# Altium schematic sheet Dano[01].SchDoc: DANO USB C
size A3; Organization: Altium Limited; Address1: L3, 12a Rodborough Rd; Address2: Frenchs Forest; Address3: NSW; Address4: Australia 2086
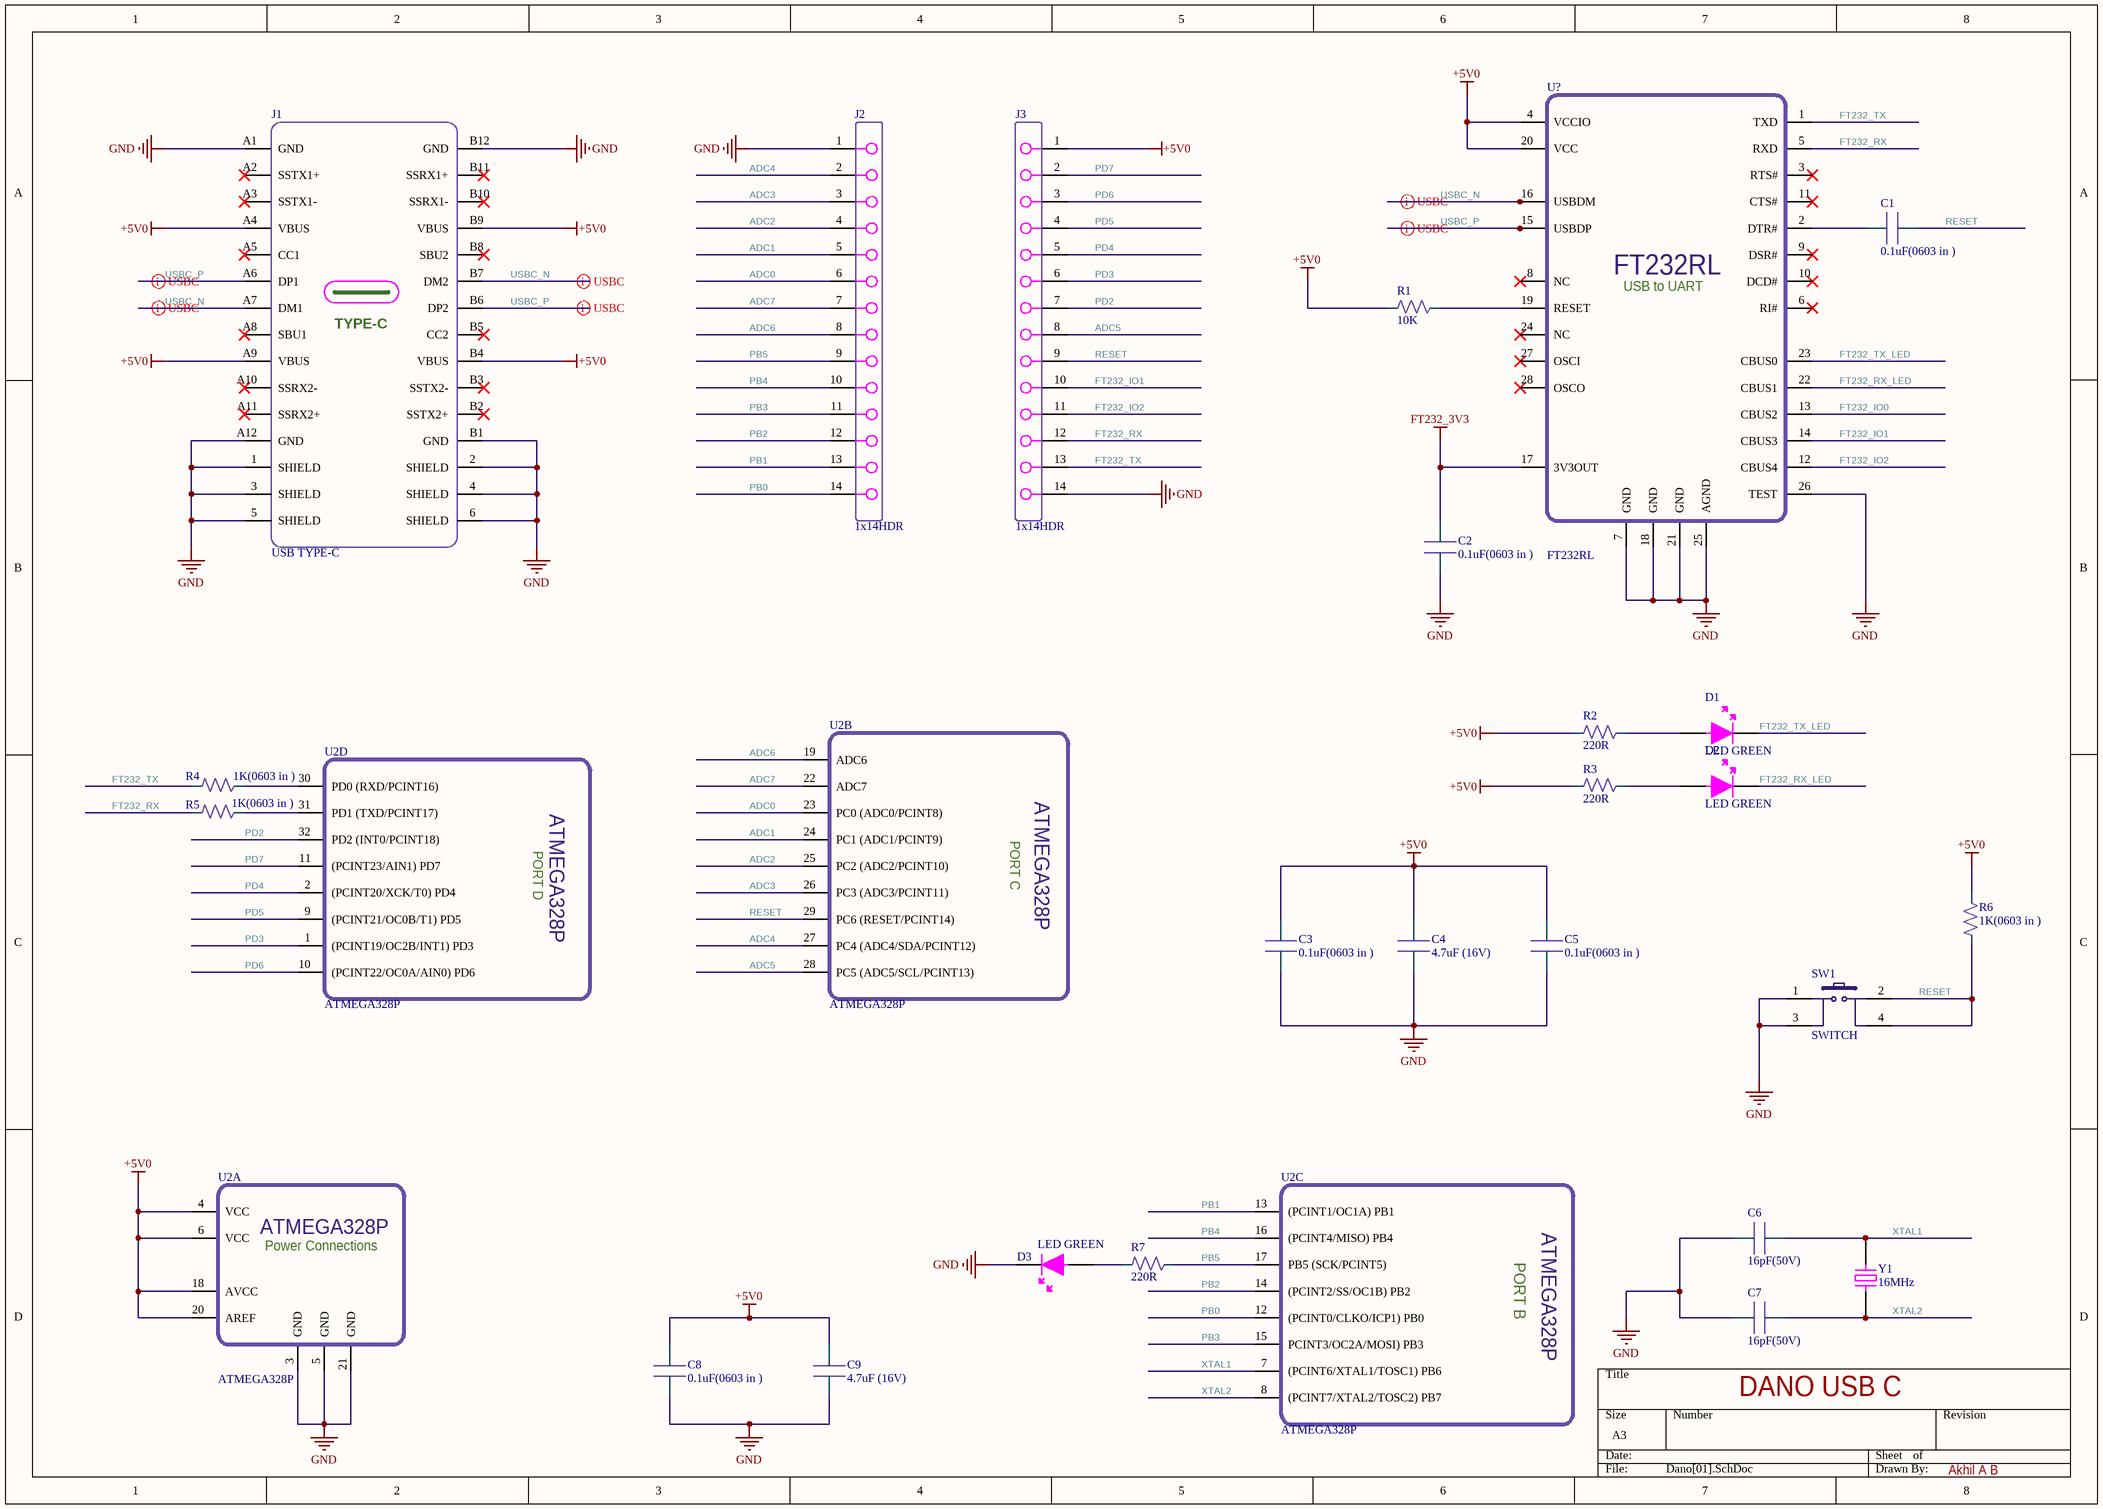
[diagram p0: Dano[01].SchDoc]

## Parts
C1  0.1uF(0603 in )  [Capacitor_0603]
C2  0.1uF(0603 in )  [Capacitor_0603]
C3  0.1uF(0603 in )  [Capacitor_0603]
C4  4.7uF (16V)  [Capacitor_0603]
C5  0.1uF(0603 in )  [Capacitor_0603]
C6  16pF(50V)  [Capacitor_0603]
C7  16pF(50V)  [Capacitor_0603]
C8  0.1uF(0603 in )  [Capacitor_0603]
C9  4.7uF (16V)  [Capacitor_0603]
D1  LED GREEN  [0603_LED]
D2  LED GREEN  [0603_LED]
D3  LED GREEN  [0603_LED]
J1  USB TYPE-C  [USB TYPE C]
J2  1x14HDR  [1x14 HDR_P2.54]
J3  1x14HDR  [1x14 HDR_P2.54]
R1  10K  [RESISTOR0603]
R2  220R  [RESISTOR0603]
R3  220R  [RESISTOR0603]
R4  1K(0603 in )  [RESISTOR0603]
R5  1K(0603 in )  [RESISTOR0603]
R6  1K(0603 in )  [RESISTOR0603]
R7  220R  [RESISTOR0603]
SW1  SWITCH  [PushButton nf]
U2  ATMEGA328P  [32TQFP]  (parts A,B,C,D of 4)
U?  FT232RL  [SSOP28_]
Y1  16MHz  [16MHz_Oscillator]

## Nets
+5V0: C3.2 C4.2 C5.2 C8.2 C9.2 J1.A4(VBUS) J1.A9(VBUS) J1.B4(VBUS) J1.B9(VBUS) J3.1 R1.1 R2.1 R3.1 R6.2 U2.4(VCC) U2.6(VCC) U2.18(AVCC) U2.20(AREF) U?.4(VCCIO) U?.20(VCC)
FT232_3V3: C2.2 U?.17(3V3OUT)
GND: C2.1 C3.1 C4.1 C5.1 C6.1 C7.1 C8.1 C9.1 D3.2 J1.1(SHIELD) J1.2(SHIELD) J1.3(SHIELD) J1.4(SHIELD) J1.5(SHIELD) J1.6(SHIELD) J1.A1(GND) J1.A12(GND) J1.B1(GND) J1.B12(GND) J2.1 J3.14 SW1.1 SW1.3 U2.3(GND) U2.5(GND) U2.21(GND) U?.7(GND) U?.18(GND) U?.21(GND) U?.25(AGND) U?.26(TEST)
ADC0: J2.6 U2.23(PC0_(ADC0/PCINT8))
ADC1: J2.5 U2.24(PC1_(ADC1/PCINT9))
ADC2: J2.4 U2.25(PC2_(ADC2/PCINT10))
ADC3: J2.3 U2.26(PC3_(ADC3/PCINT11))
ADC4: J2.2 U2.27(PC4_(ADC4/SDA/PCINT12))
ADC5: J3.8 U2.28(PC5_(ADC5/SCL/PCINT13))
ADC6: J2.8 U2.19(ADC6)
ADC7: J2.7 U2.22(ADC7)
FT232_IO0: U?.13(CBUS2)
FT232_IO1: J3.10 U?.14(CBUS3)
FT232_IO2: J3.11 U?.12(CBUS4)
FT232_RX: J3.12 R5.1 U?.5(RXD)
FT232_RX_LED: D2.2 U?.22(CBUS1)
FT232_TX: J3.13 R4.1 U?.1(TXD)
FT232_TX_LED: D1.2 U?.23(CBUS0)
PB0: J2.14 U2.12((PCINT0/CLKO/ICP1)_PB0)
PB1: J2.13 U2.13((PCINT1/OC1A)_PB1)
PB2: J2.12 U2.14((PCINT2/SS/OC1B)_PB2)
PB3: J2.11 U2.15(PCINT3/OC2A/MOSI)_PB3)
PB4: J2.10 U2.16((PCINT4/MISO)_PB4)
PB5: J2.9 R7.2 U2.17(PB5_(SCK/PCINT5))
PD2: J3.7 U2.32(PD2_(INT0/PCINT18))
PD3: J3.6 U2.1((PCINT19/OC2B/INT1)_PD3)
PD4: J3.5 U2.2((PCINT20/XCK/T0)_PD4)
PD5: J3.4 U2.9((PCINT21/OC0B/T1)_PD5)
PD6: J3.3 U2.10((PCINT22/OC0A/AIN0)_PD6)
PD7: J3.2 U2.11((PCINT23/AIN1)_PD7)
RESET: C1.2 J3.9 R6.1 SW1.2 SW1.4 U2.29(PC6_(RESET/PCINT14))
USBC_N: J1.A7(DM1) J1.B7(DM2) U?.16(USBDM)
USBC_P: J1.A6(DP1) J1.B6(DP2) U?.15(USBDP)
XTAL1: C6.2 U2.7((PCINT6/XTAL1/TOSC1)_PB6) Y1.2
XTAL2: C7.2 U2.8((PCINT7/XTAL2/TOSC2)_PB7) Y1.1
NetC1_1: C1.1 U?.2(DTR#)
NetD1_1: D1.1 R2.2
NetD2_1: D2.1 R3.2
NetD3_1: D3.1 R7.1
NetR1_2: R1.2 U?.19(RESET)
NetR4_2: R4.2 U2.30(PD0_(RXD/PCINT16))
NetR5_2: R5.2 U2.31(PD1_(TXD/PCINT17))

Not connected (* = marked no-connect by the designer): J1 A2(SSTX1+)* A3(SSTX1-)* A5(CC1)* A8(SBU1)* A10(SSRX2-)* A11(SSRX2+)* B2(SSTX2+)* B3(SSTX2-)* B5(CC2)* B8(SBU2)* B10(SSRX1-)* B11(SSRX1+)*; U? 3(RTS#)* 6(RI#)* 8(NC)* 9(DSR#)* 10(DCD#)* 11(CTS#)* 24(NC)* 27(OSCI)* 28(OSCO)*

## Layout directives
differential pair: USBC_N, USBC_P

## Notes on the sheet
- Akhil A B
- Title
- Size:
- Date:
- File:
- A2
- Number:
- Time:
- Revision:
- Sheet
- of
- (in symbol ATMEGA328PB-AUR, part A) Power Connections
- (in symbol ATMEGA328PB-AUR, part B) PORT C
- (in symbol ATMEGA328PB-AUR, part C) PORT B
- (in symbol ATMEGA328PB-AUR, part D) PORT D
- (in symbol C-ARA1-AK511) TYPE-C
- (in symbol FT232RL-REEL) USB to UART

## Library data of the parts
C1-C3 C5 C8 = C0603X104J4RECAUTO: 0.1µF ±5% 16V Ceramic Capacitor X7R 0603 (1608 Metric); Min Temp: -55°C; Max Temp: 125°C; Manufacturer Part Number: C0603X104J4RECAUTO; Supplier Part Number: 399-17843-1-ND; Part Status: Active; Price: 0.21; ComponentLink1Description: Supplier Link; ComponentLink1URL: https://www.digikey.com/en/products/detail/kemet/C0603X104J4RECAUTO/8640437
C4 C9 = GRM188R61C475KE11D: 4.7µF ±10% 16V Ceramic Capacitor X5R 0603 (1608 Metric); Manufacturer: Murata Electronics; MinTemp: -55°C; MaxTemp: 85°C; ManufacturerPartNumber: GRM188R61C475KE11D; SupplierPartNumber: 490-10730-1-ND; Supplier: Digikey; PartStatus: Active; Price: 0.36; ComponentLink1Description: SupplierURL; ComponentLink1URL: https://www.digikey.com/en/products/detail/murata-electronics/GRM188R61C475KE11D/4905341
C6 C7 = C0603C160J5GACAUTO: 16pF ±5% 50V Ceramic Capacitor C0G, NP0 0603 (1608 Metric); Manufacturer: KEMET; MinTemp: -55°C; MaxTemp: 125°C; ManufacturerPartNumber: C0603C160J5GACAUTO; SupplierPartNumber: 399-15901-1-ND; Supplier: Digikey; PartStatus: Active; Price: 0.34; ComponentLink1Description: SupplierURL; ComponentLink1URL: https://www.digikey.com/en/products/detail/kemet/C0603C160J5GACAUTO/7516135
D1-D3 = XZVG53W-8: Green 570nm LED Indication - Discrete 2.1V 0603 (1608 Metric); Min Temp: -40°C; Max Temp: +85°C; Manufacturer Part Number: XZVG53W-8; Supplier Part Number: 1497-1215-1-ND; Part Status: Active; Price: 0.36; ComponentLink1Description: Supplier Link; ComponentLink1URL: https://www.digikey.com/en/products/detail/sunled/XZVG53W-8/4745971
J1 = C-ARA1-AK511: USB-C (USB TYPE-C) USB 3.2 Gen 1 (USB 3.1 Gen 1, Superspeed (USB 3.0)) Receptacle Connector 24 Position Surface Mount, Right Angle; Through Hole; Manufacturer: CNC Tech; MinTemp: -40°C; MaxTemp: 85°C; ManufacturerPartNumber: C-ARA1-AK511; SupplierPartNumber: 1175-1893-1-ND; Supplier: Digikey; PartStatus: Active; Price: 3.75; ComponentLink1Description: SupplierURL; ComponentLink1URL: https://www.digikey.com/en/products/detail/cnc-tech/C-ARA1-AK511/8637927
J2 J3 = 61301411121: Connector Header Through Hole 14 position 0.100" (2.54mm); Manufacturer: Würth Elektronik; MinTemp: -40°C; MaxTemp: 105°C; ManufacturerPartNumber: 61301411121; SupplierPartNumber: 732-5325-ND; Supplier: Digikey; PartStatus: Active; Price: 0.74; ComponentLink1Description: SupplierURL; ComponentLink1URL: https://www.digikey.com/en/products/detail/würth-elektronik/61301411121/4846849
R1 = RMCF0603JT10K0: 10 kOhms ±5% 0.1W, 1/10W Chip Resistor 0603 (1608 Metric) Automotive AEC-Q200 Thick Film; Manufacturer: Stackpole Electronics Inc; MinTemp: -55°C; MaxTemp: 155°C; ManufacturerPartNumber: RMCF0603JT10K0; SupplierPartNumber: RMCF0603JT10K0CT-ND; Supplier: Digikey; PartStatus: Active; Price: 0.10; ComponentLink1Description: SupplierURL; ComponentLink1URL: https://www.digikey.com/en/products/detail/stackpole-electronics-inc/RMCF0603JT10K0/1758104
R2 R3 R7 = RMCF0603JT220R: 220 Ohms ±5% 0.1W, 1/10W Chip Resistor 0603 (1608 Metric) Automotive AEC-Q200 Thick Film; Manufacturer: Stackpole Electronics Inc; MinTemp: -55°C; MaxTemp: 155°C; ManufacturerPartNumber: RMCF0603JT220R; SupplierPartNumber: RMCF0603JT220RCT-ND; Supplier: Digikey; PartStatus: Active; Price: 0.10; ComponentLink1Description: SupplierURL; ComponentLink1URL: https://www.digikey.com/en/products/detail/stackpole-electronics-inc/RMCF0603JT220R/1758014
R4-R6 = CR0603-16W-1001FT: 1 kOhms ±1% 0.063W, 1/16W Chip Resistor 0603 (1608 Metric)  Thick Film; Min Temp: -55°C; Max Temp: 155°C; Manufacturer Part Number: CR0603-16W-1001FT; Supplier Part Number: 2679-CR0603-16W-1001FTTR-ND; Part Status: Active; Price: ---; ComponentLink1Description: Supplier Link; ComponentLink1URL: https://www.digikey.com/en/products/detail/venkel/CR0603-16W-1001FT/12327254
SW1 = TL1105DF160Q: Tactile Switch SPST-NO Top Actuated Surface Mount; Manufacturer: E-Switch; MinTemp: -20°C; MaxTemp: 70°C; ManufacturerPartNumber: TL1105DF160Q; SupplierPartNumber: EG1865-ND; Supplier: Digikey; PartStatus: Active; Price: 0.17; ComponentLink1Description: SupplierURL; ComponentLink1URL: https://www.digikey.com/en/products/detail/e-switch/TL1105DF160Q/271562
U2 = ATMEGA328PB-AUR: AVR AVR® ATmega, Functional Safety (FuSa) Microcontroller IC 8-Bit 20MHz 32KB (16K x 16) FLASH 32-TQFP (7x7); Manufacturer: Microchip Technology; MinTemp: -40°C; MaxTemp: 85°C; ManufacturerPartNumber: ATMEGA328PB-AUR; SupplierPartNumber: ATMEGA328PB-AURCT-ND; Supplier: Digikey; PartStatus: Active; Price: 1.56; ComponentLink1Description: SupplierURL; ComponentLink1URL: https://www.digikey.com/en/products/detail/microchip-technology/ATMEGA328PB-AUR/5638753
U? = FT232RL-REEL: USB Bridge, USB to UART USB 2.0 UART Interface 28-SSOP; Manufacturer: FTDI, Future Technology Devices International Ltd; MinTemp: -40°C; MaxTemp: 85°C; ManufacturerPartNumber: FT232RL-REEL; SupplierPartNumber: 768-1007-1-ND; Supplier: Digikey; PartStatus: Active; Price: 4.50; ComponentLink1Description: SupplierURL; ComponentLink1URL: https://www.digikey.com/en/products/detail/ftdi-future-technology-devices-international-ltd/FT232RL-REEL/1836385
Y1 = LFXTAL003237BULK: 16MHz ±30ppm Crystal 16pF 40 Ohms HC-49/US; Manufacturer: IQD Frequency Products; MinTemp: -10°C; MaxTemp: 60°C; ManufacturerPartNumber: LFXTAL003237BULK; SupplierPartNumber: 1923-1461-ND; Supplier: Digikey; PartStatus: Active; Price: 0.54; ComponentLink1Description: SupplierURL; ComponentLink1URL: https://www.digikey.com/en/products/detail/iqd-frequency-products/LFXTAL003237BULK/8633749